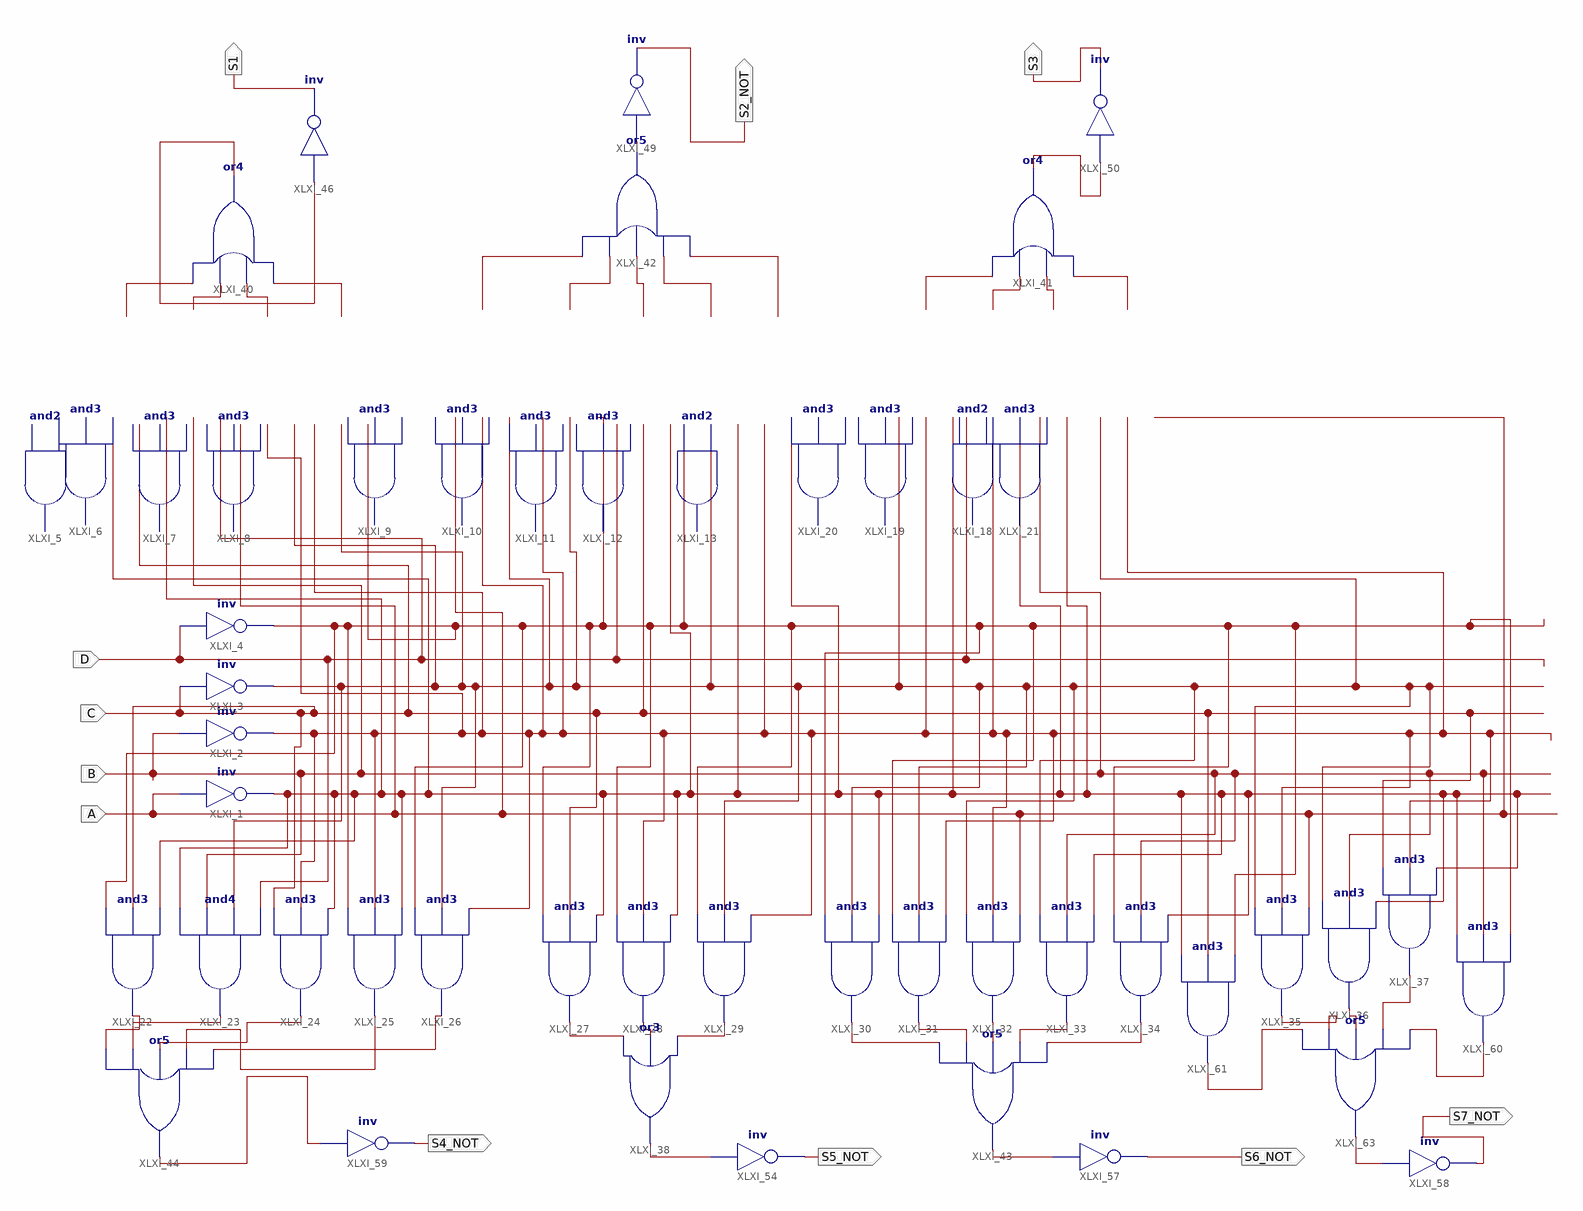
[diagram p0: schematic sheet 1]
// Xilinx ISE schematic BCD_7_SEG_DECODER.sch (spartan3e) as structural Verilog: 49 symbols, 11 ports
module BCD_7_SEG_DECODER (
  input  D,
  input  B,
  input  A,
  input  C,
  output S3,
  output S1,
  output S2_NOT,
  output S5_NOT,
  output S6_NOT,
  output S7_NOT,
  output S4_NOT
);

  wire NOT_A, NOT_B, NOT_C, NOT_D, S2, S4, S5, S6, S7, XLXN_39, XLXN_40, XLXN_41, XLXN_42, XLXN_43, XLXN_44,
       XLXN_45, XLXN_46, XLXN_47, XLXN_48, XLXN_49, XLXN_50, XLXN_51, XLXN_52, XLXN_55, XLXN_56, XLXN_57,
       XLXN_58, XLXN_59, XLXN_60, XLXN_61, XLXN_62, XLXN_63, XLXN_64, XLXN_65, XLXN_66, XLXN_67, XLXN_130,
       XLXN_136, XLXN_173, XLXN_174, XLXN_176, XLXN_179;

  and XLXI_5 (XLXN_39, NOT_A, C);
  and XLXI_6 (XLXN_40, NOT_A, B, D);
  and XLXI_7 (XLXN_41, A, NOT_B, NOT_C);
  and XLXI_8 (XLXN_42, NOT_B, NOT_C, NOT_D);
  and XLXI_9 (XLXN_43, A, NOT_B, NOT_C);
  and XLXI_10 (XLXN_44, NOT_B, NOT_C, NOT_D);
  and XLXI_11 (XLXN_45, D, C, NOT_A);
  and XLXI_12 (XLXN_46, NOT_D, NOT_C, NOT_A);
  and XLXI_13 (XLXN_47, NOT_B, NOT_A);
  not XLXI_2 (NOT_B, B);
  not XLXI_1 (NOT_A, A);
  not XLXI_3 (NOT_C, C);
  not XLXI_4 (NOT_D, D);
  and XLXI_18 (XLXN_50, B, NOT_A);
  and XLXI_19 (XLXN_49, D, NOT_B, NOT_A);
  and XLXI_20 (XLXN_48, NOT_C, NOT_B, NOT_A);
  and XLXI_21 (XLXN_51, NOT_C, NOT_B, A);
  and XLXI_22 (XLXN_67, NOT_D, C, NOT_A);
  and XLXI_23 (XLXN_66, NOT_A, B, NOT_C, D);
  and XLXI_24 (XLXN_65, C, NOT_B, NOT_A);
  and XLXI_25 (XLXN_64, NOT_D, NOT_B, NOT_A);
  and XLXI_26 (XLXN_63, NOT_D, NOT_C, NOT_B);
  and XLXI_27 (XLXN_62, NOT_D, C, NOT_A);
  and XLXI_28 (XLXN_61, NOT_D, NOT_B, NOT_A);
  and XLXI_29 (XLXN_60, NOT_D, NOT_C, NOT_B);
  and XLXI_30 (XLXN_59, NOT_D, NOT_C, NOT_A);
  and XLXI_31 (XLXN_58, NOT_D, NOT_C, NOT_B);
  and XLXI_32 (XLXN_57, NOT_C, NOT_B, A);
  and XLXI_33 (XLXN_56, NOT_C, B, NOT_A);
  and XLXI_34 (XLXN_55, NOT_D, B, NOT_A);
  and XLXI_35 (XLXN_174, NOT_C, NOT_B, A);
  and XLXI_36 (S7, NOT_C, B, NOT_A);
  and XLXI_37 (XLXN_52, C, NOT_B, NOT_A);
  or XLXI_38 (S5, XLXN_62, XLXN_61, XLXN_60);
  or XLXI_40 (XLXN_130, XLXN_42, XLXN_41, XLXN_40, XLXN_39);
  or XLXI_41 (XLXN_136, XLXN_51, XLXN_50, XLXN_49, XLXN_48);
  or XLXI_42 (S2, XLXN_47, XLXN_46, XLXN_45, XLXN_44, XLXN_43);
  or XLXI_43 (S6, XLXN_59, XLXN_58, XLXN_57, XLXN_56, XLXN_55);
  or XLXI_44 (S4, XLXN_67, XLXN_66, XLXN_65, XLXN_64, XLXN_63);
  not XLXI_46 (S1, XLXN_130);
  not XLXI_49 (S2_NOT, S2);
  not XLXI_50 (S3, XLXN_136);
  not XLXI_54 (S5_NOT, S5);
  not XLXI_57 (S6_NOT, S6);
  not XLXI_58 (S7_NOT, XLXN_179);
  not XLXI_59 (S4_NOT, S4);
  and XLXI_60 (XLXN_176, NOT_A, B, NOT_D);
  and XLXI_61 (XLXN_173, NOT_A, C, NOT_D);
  or XLXI_63 (XLXN_179, XLXN_173, XLXN_174, S7, XLXN_52, XLXN_176);
endmodule
